# Altium project ArtixDuo.PrjPcb (part 4 of 8)

## Sheet PMU.SchDoc
size A2; SheetNumber: 3; SheetTotal: 12
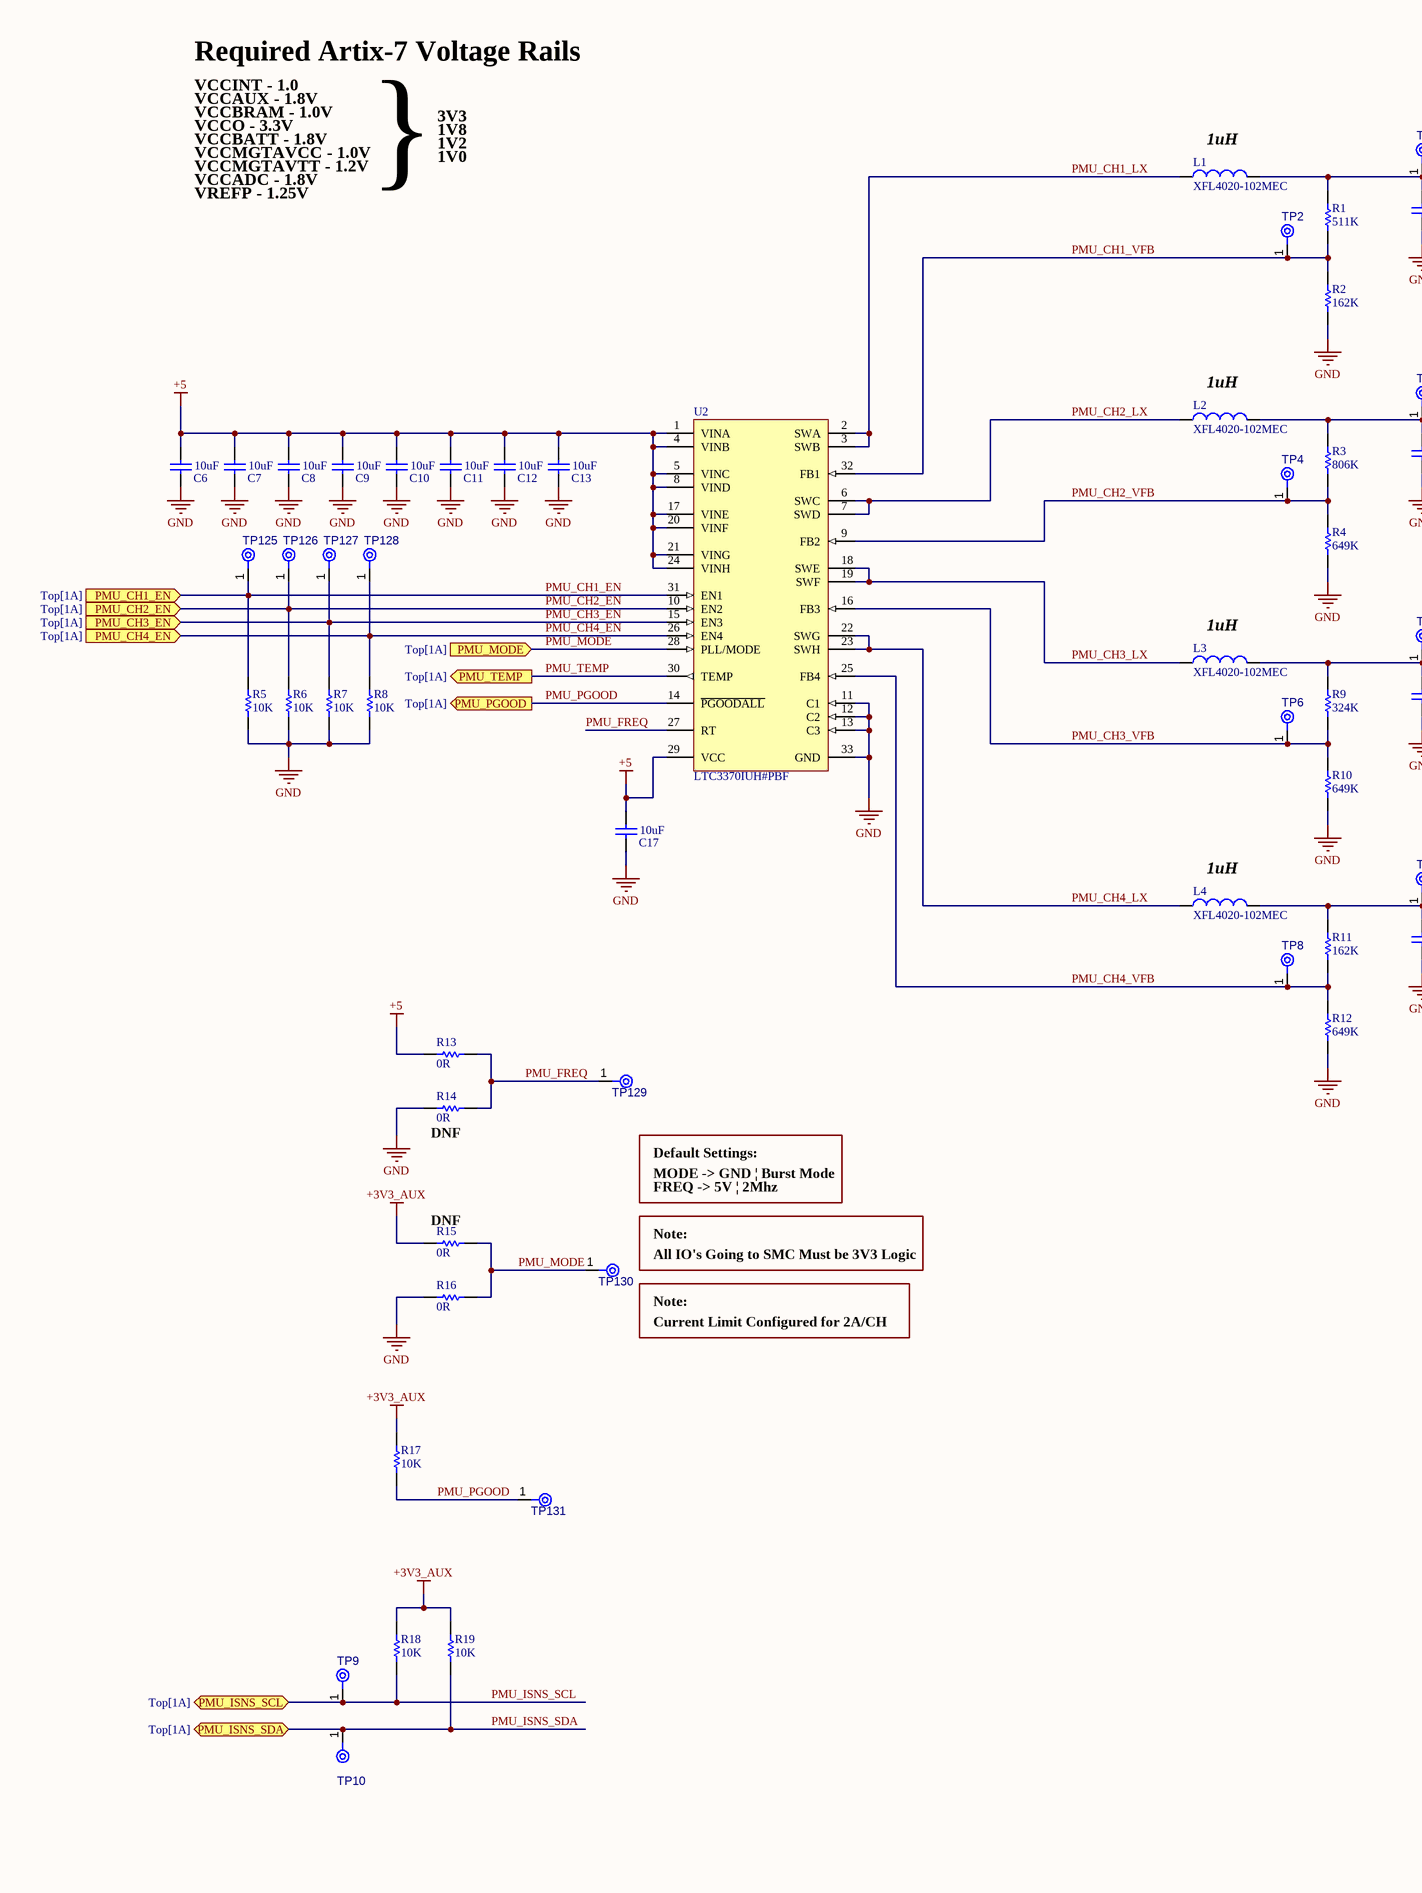
[diagram p12: PMU.SchDoc, left]
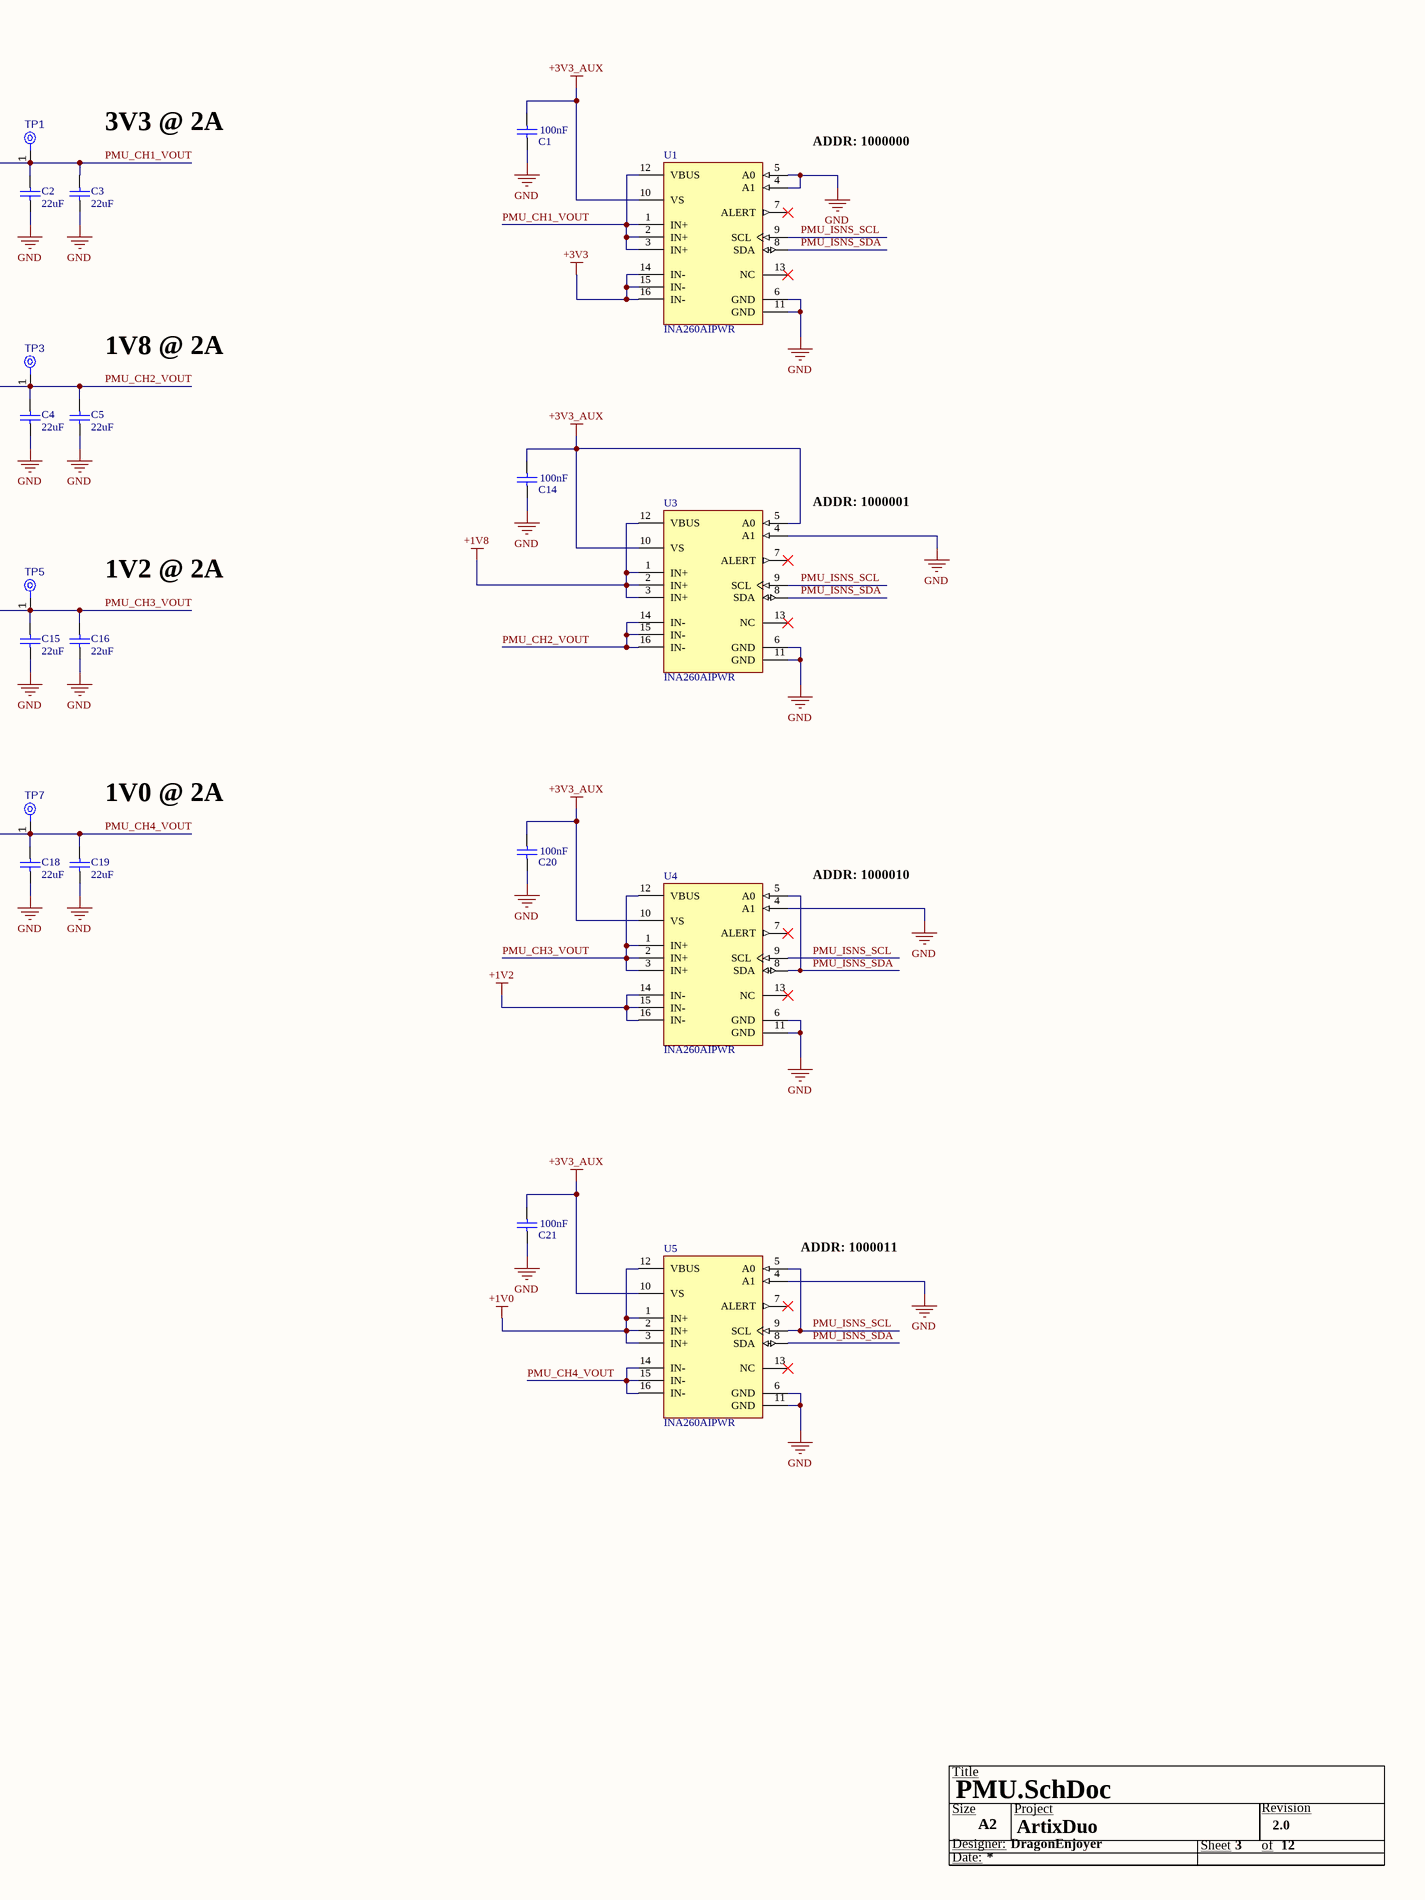
[diagram p13: PMU.SchDoc, right]

### Parts
(Parts that share a designator on the sheet are numbered #1, #2 ... from top to bottom, then left to right.)
*#5  Size: A2  (hidden comment: Title Block)  (graphical)
C1  100nF  [CAPC1005X05N]
C2  value 22uF  [CAPC3216X18N]  (hidden comment: GCM31CR71A226KE02L)
C3  value 22uF  [CAPC3216X18N]  (hidden comment: GCM31CR71A226KE02L)
C4  value 22uF  [CAPC3216X18N]  (hidden comment: GCM31CR71A226KE02L)
C5  value 22uF  [CAPC3216X18N]  (hidden comment: GCM31CR71A226KE02L)
C6  10uF  [CAPC0805(2012)145_L]
C7  10uF  [CAPC0805(2012)145_L]
C8  10uF  [CAPC0805(2012)145_L]
C9  10uF  [CAPC0805(2012)145_L]
C10  10uF  [CAPC0805(2012)145_L]
C11  10uF  [CAPC0805(2012)145_L]
C12  10uF  [CAPC0805(2012)145_L]
C13  10uF  [CAPC0805(2012)145_L]
C14  100nF  [CAPC1005X05N]
C15  value 22uF  [CAPC3216X18N]  (hidden comment: GCM31CR71A226KE02L)
C16  value 22uF  [CAPC3216X18N]  (hidden comment: GCM31CR71A226KE02L)
C17  10uF  [CAPC0805(2012)145_L]
C18  value 22uF  [CAPC3216X18N]  (hidden comment: GCM31CR71A226KE02L)
C19  value 22uF  [CAPC3216X18N]  (hidden comment: GCM31CR71A226KE02L)
C20  100nF  [CAPC1005X05N]
C21  100nF  [CAPC1005X05N]
L1  XFL4020-102MEC  [COIL-XFL4020_V]
L2  XFL4020-102MEC  [COIL-XFL4020_V]
L3  XFL4020-102MEC  [COIL-XFL4020_V]
L4  XFL4020-102MEC  [COIL-XFL4020_V]
R1  511K  [RESC1005X40X25NL05T10]
R2  162K  [RESC1005X40X25NL05T10]
R3  806K  [RESC1005X40X25NL05T10]
R4  649K  [RESC1005X40X25NL05T10]
R5  10K  [RESC1005X40X25NL05T10]
R6  10K  [RESC1005X40X25NL05T10]
R7  10K  [RESC1005X40X25NL05T10]
R8  10K  [RESC1005X40X25NL05T10]
R9  324K  [RESC1005X40X25NL05T10]
R10  649K  [RESC1005X40X25NL05T10]
R11  162K  [RESC1005X40X25NL05T10]
R12  649K  [RESC1005X40X25NL05T10]
R13  0R  [RESC1005X40X25NL05T10]
R14  0R  [RESC1005X40X25NL05T10]
R15  0R  [RESC1005X40X25NL05T10]
R16  0R  [RESC1005X40X25NL05T10]
R17  10K  [RESC1005X40X25NL05T10]
R18  10K  [RESC1005X40X25NL05T10]
R19  10K  [RESC1005X40X25NL05T10]
TP1  TPAD6R  [TP06R]  (value not drawn)  (no BOM)
TP2  TPAD6R  [TP06R]  (value not drawn)  (no BOM)
TP3  TPAD6R  [TP06R]  (value not drawn)  (no BOM)
TP4  TPAD6R  [TP06R]  (value not drawn)  (no BOM)
TP5  TPAD6R  [TP06R]  (value not drawn)  (no BOM)
TP6  TPAD6R  [TP06R]  (value not drawn)  (no BOM)
TP7  TPAD6R  [TP06R]  (value not drawn)  (no BOM)
TP8  TPAD6R  [TP06R]  (value not drawn)  (no BOM)
TP9  TPAD6R  [TP06R]  (value not drawn)  (no BOM)
TP10  TPAD6R  [TP06R]  (value not drawn)  (no BOM)
TP125  TPAD6R  [TP06R]  (value not drawn)  (no BOM)
TP126  TPAD6R  [TP06R]  (value not drawn)  (no BOM)
TP127  TPAD6R  [TP06R]  (value not drawn)  (no BOM)
TP128  TPAD6R  [TP06R]  (value not drawn)  (no BOM)
TP129  TPAD6R  [TP06R]  (value not drawn)  (no BOM)
TP130  TPAD6R  [TP06R]  (value not drawn)  (no BOM)
TP131  TPAD6R  [TP06R]  (value not drawn)  (no BOM)
U1  INA260AIPWR  [FP-PW0016A-IPC_B]
U2  LTC3370IUH#PBF  [QFN50P500X500X80_HS-33N]
U3  INA260AIPWR  [FP-PW0016A-IPC_B]
U4  INA260AIPWR  [FP-PW0016A-IPC_B]
U5  INA260AIPWR  [FP-PW0016A-IPC_B]

### Ports
PMU_CH1_EN (in, see Top[1A]), PMU_CH2_EN (in, see Top[1A]), PMU_CH3_EN (in, see Top[1A]), PMU_CH4_EN (in, see Top[1A]), PMU_ISNS_SCL (bidir, see Top[1A]), PMU_ISNS_SDA (bidir, see Top[1A]), PMU_MODE (in, see Top[1A]), PMU_PGOOD (out, see Top[1A]), PMU_TEMP (out, see Top[1A])

### Nets
+1V0: U5.1(IN+) U5.2(IN+) U5.3(IN+) U5.12(VBUS)
+1V2: U4.14(IN-) U4.15(IN-) U4.16(IN-)
+1V8: U3.1(IN+) U3.2(IN+) U3.3(IN+) U3.12(VBUS)
+3V3: U1.14(IN-) U1.15(IN-) U1.16(IN-)
+3V3_AUX: C1.2 C14.2 C20.2 C21.2 R15.1 R17.2 R18.2 R19.2 U1.10(VS) U3.5(A0) U3.10(VS) U4.10(VS) U5.10(VS)
+5: C6.2 C7.2 C8.2 C9.2 C10.2 C11.2 C12.2 C13.2 C17.2 R13.1 U2.1(VINA) U2.4(VINB) U2.5(VINC) U2.8(VIND) U2.17(VINE) U2.20(VINF) U2.21(VING) U2.24(VINH) U2.29(VCC)  [project net USB_5V0_AUX_IN]
GND: C1.1 C2.1 C3.1 C4.1 C5.1 C6.1 C7.1 C8.1 C9.1 C10.1 C11.1 C12.1 C13.1 C14.1 C15.1 C16.1 C17.1 C18.1 C19.1 C20.1 C21.1 R2.2 R4.1 R5.1 R6.1 R7.1 R8.1 R10.1 R12.1 R14.1 R16.1 U1.4(A1) U1.5(A0) U1.6(GND) U1.11(GND) U2.11(C1) U2.12(C2) U2.13(C3) U2.33(GND) U3.4(A1) U3.6(GND) U3.11(GND) U4.4(A1) U4.6(GND) U4.11(GND) U5.4(A1) U5.6(GND) U5.11(GND)
PMU_CH1_EN: R5.2 TP125.1(TP) U2.31(EN1) ; port PMU_CH1_EN
PMU_CH1_LX: L1.1 U2.2(SWA) U2.3(SWB)
PMU_CH1_VFB: R1.1 R2.1 TP2.1(TP) U2.32(FB1)
PMU_CH1_VOUT: C2.2 C3.2 L1.2 R1.2 TP1.1(TP) U1.1(IN+) U1.2(IN+) U1.3(IN+) U1.12(VBUS)
PMU_CH2_EN: R6.2 TP126.1(TP) U2.10(EN2) ; port PMU_CH2_EN
PMU_CH2_LX: L2.1 U2.6(SWC) U2.7(SWD)
PMU_CH2_VFB: R3.1 R4.2 TP4.1(TP) U2.9(FB2)
PMU_CH2_VOUT: C4.2 C5.2 L2.2 R3.2 TP3.1(TP) U3.14(IN-) U3.15(IN-) U3.16(IN-)
PMU_CH3_EN: R7.2 TP127.1(TP) U2.15(EN3) ; port PMU_CH3_EN
PMU_CH3_LX: L3.1 U2.18(SWE) U2.19(SWF)
PMU_CH3_VFB: R9.1 R10.2 TP6.1(TP) U2.16(FB3)
PMU_CH3_VOUT: C15.2 C16.2 L3.2 R9.2 TP5.1(TP) U4.1(IN+) U4.2(IN+) U4.3(IN+) U4.12(VBUS)
PMU_CH4_EN: R8.2 TP128.1(TP) U2.26(EN4) ; port PMU_CH4_EN
PMU_CH4_LX: L4.1 U2.22(SWG) U2.23(SWH)
PMU_CH4_VFB: R11.2 R12.2 TP8.1(TP) U2.25(FB4)
PMU_CH4_VOUT: C18.2 C19.2 L4.2 R11.1 TP7.1(TP) U5.14(IN-) U5.15(IN-) U5.16(IN-)
PMU_FREQ: R13.2 R14.2 TP129.1(TP) U2.27(RT)
PMU_ISNS_SCL: R18.1 TP9.1(TP) U1.9(SCL) U3.9(SCL) U4.9(SCL) U5.5(A0) U5.9(SCL) ; port PMU_ISNS_SCL
PMU_ISNS_SDA: R19.1 TP10.1(TP) U1.8(SDA) U3.8(SDA) U4.5(A0) U4.8(SDA) U5.8(SDA) ; port PMU_ISNS_SDA
PMU_MODE: R15.2 R16.2 TP130.1(TP) U2.28(PLL/MODE) ; port PMU_MODE
PMU_PGOOD: R17.1 TP131.1(TP) U2.14(~{PGOODALL}) ; port PMU_PGOOD
PMU_TEMP: U2.30(TEMP) ; port PMU_TEMP

Not connected (* = marked no-connect by the designer): U1 7(ALERT)* 13(NC)*; U3 7(ALERT)* 13(NC)*; U4 7(ALERT)* 13(NC)*; U5 7(ALERT)* 13(NC)*

### Notes on the sheet
- Required Artix-7 Voltage Rails
- VCCINT - 1.0
- VCCAUX - 1.8V
- VCCBRAM - 1.0V
- VCCO - 3.3V
- 3V3
- 1V8
- VCCBATT - 1.8V
- VCCMGTAVCC - 1.0V
- VCCMGTAVTT - 1.2V
- VCCADC - 1.8V
- VREFP - 1.25V
- }
- 1V2
- 1V0
- (near L1) 1uH
- 3V3 @ 2A
- ADDR: 1000000
- (near L2) 1uH
- 1V8 @ 2A
- ADDR: 1000001
- (near L3) 1uH
- 1V2 @ 2A
- (near L4) 1uH
- 1V0 @ 2A
- ADDR: 1000010
- (near R14) DNF
- Default Settings:
- MODE -> GND | Burst Mode
- FREQ -> 5V | 2Mhz
- (near R15) DNF
- Note:
- All IO's Going to SMC Must be 3V3 Logic
- Current Limit Configured for 2A/CH
- (near U5) ADDR: 1000011
- (in symbol CMP-007-000006-8) Title; Size; Project; Revision; Designer:; Sheet; of; Date:

### Library data of the parts
*#5 = CMP-007-000006-8: Generic Title Block
C1 C14 C20 C21 = CMP-001-00095-1: as C39-C46 on sheet FPGA_1; Voltage: 50V; Capacitance: 100nF; Case: 0402
C2-C5 C15 C16 C18 C19 = CMP-001-00094-1: 1206 22 uF 10 V ±10% Tolerance X7R Multilayer Ceramic Capacitor; Voltage Rating: 10V; Tolerance: 10%; Case/Package: 1206
C6-C13 C17 = CMP-001-00093-1: Multilayer Ceramic Capacitor, 10 uF, 25 VDC, ± 10%, X7S, 0805 [2012 Metric] GRM21BC71E106KE01K
L1-L4 = CMP-2000-07423-1: Shielded Power Inductor, 1 uH, 64 MHz, -40 to 125 degC, 2-Pin SMD, RoHS, Tape and Reel; Manufacturer: Coilcraft; Case Width: 4.3mm; Case Height: 2.1mm; Maximum DC Current: 11A; Core Material: Composite; Test Frequency: 100kHz; Tolerance: 20%; Maximum DC Resistance: 11.9mOhms; Inductance: 1uH; Self Resonant Frequency: 64MHz; RoHS: Details; Series: XFL4020; Case Length: 4.3mm; Package Reference: XFL4020; Dimensions: 4.3mmWx4.3mmLx2.1mmH; Product: PowerInductors; Datasheet Version: 07/2012; Manufacturer URL: http://www.coilcraft.com/; Termination Style: SMD/SMT; Mounting Technology: SurfaceMount; Operating Temperature Range: -40Cto+125C; Package Description: 2-Pin Surface Mount Device, Body 4 x 4 mm, Pitch 2.37 mm; Shielding: Shielded; Packaging: Reel; Datasheet URL: http://www.mouser.com/ds/2/597/xfl4020-270756.pdf
R1 = CMP-2002-07728-1: RC0402FR-07511KL; Manufacturer: Yageo / Phycomp; Part Number: RC0402FR-07511KL
R2 R11 = CMP-2002-07134-1: RC0402FR-07162KL; Manufacturer: Yageo / Phycomp; Part Number: RC0402FR-07162KL
R3 = CMP-1011-00838-2: RC0402FR-07806KL; Manufacturer: Yageo / Phycomp; Part Number: RC0402FR-07806KL
R4 R10 R12 = CMP-2002-07136-1: RC0402FR-07649KL; Manufacturer: Yageo / Phycomp; Part Number: RC0402FR-07649KL
R5-R8 R17-R19 = CMP-2002-07353-1: RC0402FR-0710KL; Manufacturer: Yageo / Phycomp; Part Number: RC0402FR-0710KL
R9 = CMP-2002-07609-1: RC0402FR-07324KL; Manufacturer: Yageo; Part Number: RC0402FR-07324KL
R13-R16 = CMP-1011-00001-2: RC0402JR-070RL; Manufacturer: Yageo / Phycomp; Part Number: RC0402JR-070RL
TP1-TP10 TP125-TP131 = CMP-00028-00002-1: 0.6mm round; Pins: 1
U1 U3-U5 = CMP-04910-000015-1: IC MONITOR PWR/CURR 16TSSOP; Manufacturer: Texas Instruments; Nominal Supply Current: 310uA; Max Junction Temp: +150°C; Standoff Height: 0.05mm; Max Supply Voltage: 5.5V; Min Supply Voltage: 2.7V; Output Current: 10mA; Ambient Temperature Range High: +125°C; ComponentLink2Description: Datasheet; Manufacturer Part Number: INA260AIPWR; Automotive: No; RoHS: TRUE; Lead Free: Yes; Package: PW0016A; Device Class L2: Power Management ICs; Temperature Range Low: -40°C; Digikey Description: IC MONITOR PWR/CURR 16TSSOP; Height: 1.2mm; Temperature: -40°C to +125°C; Device Class L1: Integrated Circuits (ICs); Device Class L3: unset; Octopart: https://octopart.com/ina260aipwr-texas+instruments-75199489; Category: IC; Ambient Temperature Range Low: -40°C; Temperature Range High: +125°C; ComponentLink2URL: http://www.ti.com/lit/ds/symlink/ina260.pdf
U2 = CMP-019-00064-1: Conv DC-DC 2.7V to 5.5V Synchronous Step Down Quad-Out 0.8V to 5.5V 2A Automotive 32-Pin QFN EP Tube; Number of Outputs: 4; Min Output Voltage: 800mV; Synchronous Rectifier: Yes; Min Input Voltage: 2.25V; Output Configuration: Positive; Output Type: Adjustable; Switching Frequency: 2MHz; Min Operating Temperature: -40°C; Pins: 32; Max Output Voltage: 5.5V; Current - Output 1: 2A; Max Operating Temperature: 125°C; Output Current: 2A; Current - Output 2: 2A; Max Supply Voltage: 5.5V; Case/Package: QFN